# Altium schematic sheet Micro.SchDoc
size A4
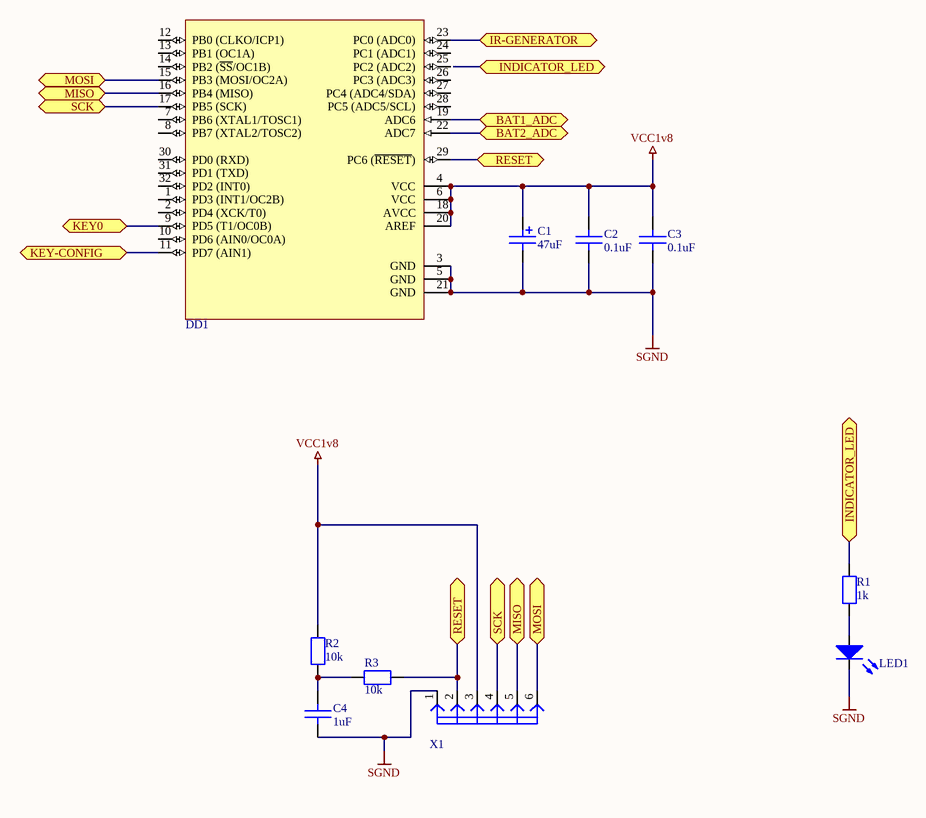
[diagram p0: Micro.SchDoc]

## Parts
C1  value 47uF  [TC2917]  (hidden comment: C47uF-10V-tant)
C2  value 0.1uF  [C0805]  (hidden comment: C0.1uF-50V)
C3  value 0.1uF  [C0805]  (hidden comment: C0.1uF-50V)
C4  value 1uF  [C0805]  (hidden comment: C1uF-50V)
DD1  ATmega328P  [32A_N]  (value not drawn)
LED1  LED-RED  [LED-3]  (value not drawn)
R1  value 1k  [R0805]  (hidden comment: R1k-5%)
R2  value 10k  [R0805]  (hidden comment: R10k-5%)
R3  value 10k  [R0805]  (hidden comment: R10k-5%)
X1  PLS-6  [PLS-6]  (value not drawn)

## Ports
BAT1_ADC, BAT2_ADC, INDICATOR_LED, IR-GENERATOR, KEY0, KEY-CONFIG, MISO, MOSI, RESET, SCK

## Nets
SGND: C1.2 C2.1 C3.1 C4.1 DD1.3(GND) DD1.5(GND) DD1.21(GND) LED1.2(K) X1.1
VCC1v8: C1.1 C2.2 C3.2 DD1.4(VCC) DD1.6(VCC) DD1.18(AVCC) DD1.20(AREF) R2.2 X1.3
BAT1_ADC: DD1.19(ADC6) ; port BAT1_ADC
BAT2_ADC: DD1.22(ADC7) ; port BAT2_ADC
INDICATOR_LED: R1.2 ; port INDICATOR_LED
IR-GENERATOR: DD1.23(PC0_(ADC0)) ; port IR-GENERATOR
KEY0: DD1.9(PD5_(T1/OC0B)) ; port KEY0
KEY-CONFIG: DD1.11(PD7_(AIN1)) ; port KEY-CONFIG
MISO: DD1.16(PB4_(MISO)) X1.5 ; port MISO
MOSI: DD1.15(PB3_(MOSI/OC2A)) X1.6 ; port MOSI
RESET: DD1.29(PC6_(~{RESET})) R3.2 X1.2 ; port RESET
SCK: DD1.17(PB5_(SCK)) X1.4 ; port SCK
NetC4_2: C4.2 R2.1 R3.1
NetLED1_1: LED1.1(A) R1.1

Not connected (* = marked no-connect by the designer): DD1 1(PD3_(INT1/OC2B)) 2(PD4_(XCK/T0)) 7(PB6_(XTAL1/TOSC1)) 8(PB7_(XTAL2/TOSC2)) 10(PD6_(AIN0/OC0A)) 12(PB0_(CLKO/ICP1)) 13(PB1_(OC1A)) 14(PB2_(~{SS}/OC1B)) 24(PC1_(ADC1)) 25(PC2_(ADC2)) 26(PC3_(ADC3)) 27(PC4_(ADC4/SDA)) 28(PC5_(ADC5/SCL)) 30(PD0_(RXD)) 31(PD1_(TXD)) 32(PD2_(INT0))

## Library data of the parts
C1 = C47uF-10V-tant: Type: Конденсатор танталовый; Voltage: 10V; Name: C47uF-10V-tant
C2 C3 = C0.1uF-50V: Type: Конденсатор керамический; Voltage: 50V; Name: C0.1uF-50V
C4 = C1uF-50V: Type: Конденсатор керамический; Voltage: 50V; Name: C1uF-50V
DD1 = ATmega328P: 8-Bit AVR Microcontroller with 32K Bytes of In-System Programmable Flash Memory; Name: ATmega328P; Type: Микроконтроллер
LED1 = LED-RED: LED red; Type: Светодиод; Color: Красный; Name: LED-RED
R1 = R1k-5%: R-1k-5%; Precision: 5%; Type: Резистор; Name: R1k-5%
R2 R3 = R10k-5%: R-10k-5%; Precision: 5%; Type: Резистор; Name: R10k-5%
X1 = PLS-6: Name: PLS-6; Type: Линейка